# Altium schematic sheet Out3.SchDoc
size A; SheetNumber: 6; SheetTotal: 6
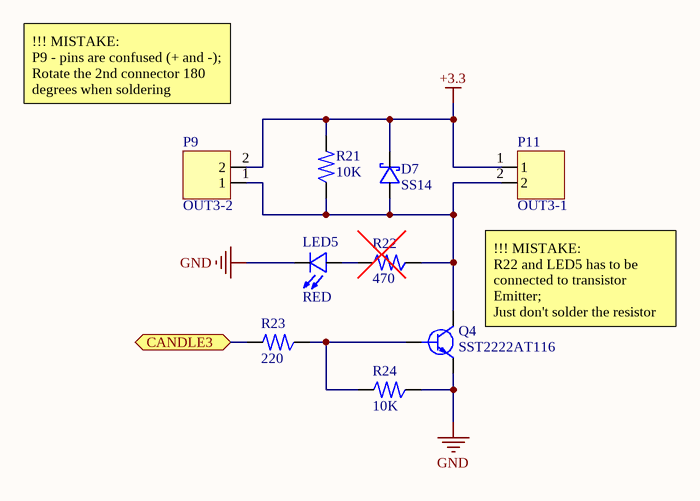
[diagram p0: Out3.SchDoc]

## Parts
D7  SS14  [SMT_DIODE_SCHTKY_VISHAI]
LED5  RED  [SMT_LED_0805(2012)_WURTH]
P9  OUT3-2  [THT_CON_WAFER_2P_NEL_2217S-02-WH2]
P11  OUT3-1  [THT_CON_WAFER_2P_NEL_2217S-02-WH2]
Q4  SST2222AT116  [SMT_TRANS_SST2222AT116_SOT23]
R21  10K  [SMT_RES_0805(2012)]
R22  470  [SMT_RES_0805(2012)]
R23  220  [SMT_RES_0805(2012)]
R24  10K  [SMT_RES_0805(2012)]

## Ports
CANDLE3 (bidir)

## Nets
+3.3: D7.2 P9.2 P11.1 R21.1
GND: LED5.1 Q4.1(E) R24.2
CANDLE3: R23.1 ; port CANDLE3
NetD7_1: D7.1 P9.1 P11.2 Q4.3(C) R21.2 R22.2
NetLED5_2: LED5.2 R22.1
NetQ4_2: Q4.2(B) R23.2 R24.1

## Notes on the sheet
- !!! MISTAKE:
  P9 - pins are confused (+ and -);
  Rotate the 2nd connector 180 degrees when soldering
- !!! MISTAKE:
  R22 and LED5 has to be connected to transistor Emitter;
  Just don't solder the resistor

## Library data of the parts
D7 = SMT_DIODE_SCHTKY_VISHAI: SMT Diode Schottky Vishay DO-214AC SS14-M3/5AT IF=1A VR=40 V FV=0.5VG
LED5 = SMT_LED_0805(2012)_WURTH: LED 0805(2012) 20mA 2V 150080YS75000 by Wurth Elektronik
P9 P11 = THT_CON_WAFER_2P_NEL_2217S-02-WH2: Connector Wafer NELTRON 2-Pins Pitch-2.54mm 250V/3A 2217S-02-WH2
Q4 = SMT_TRANS_SST2222AT116_SOT23: Transistor NPN SST2222AT116 SOT23 700mA 40V
R21-R24 = SMT_RES_0805(2012): 0805(2012) Resistor 1/4-1/8W 150V 2A